# Altium project CartApuce.PrjPcb (part 1 of 2)
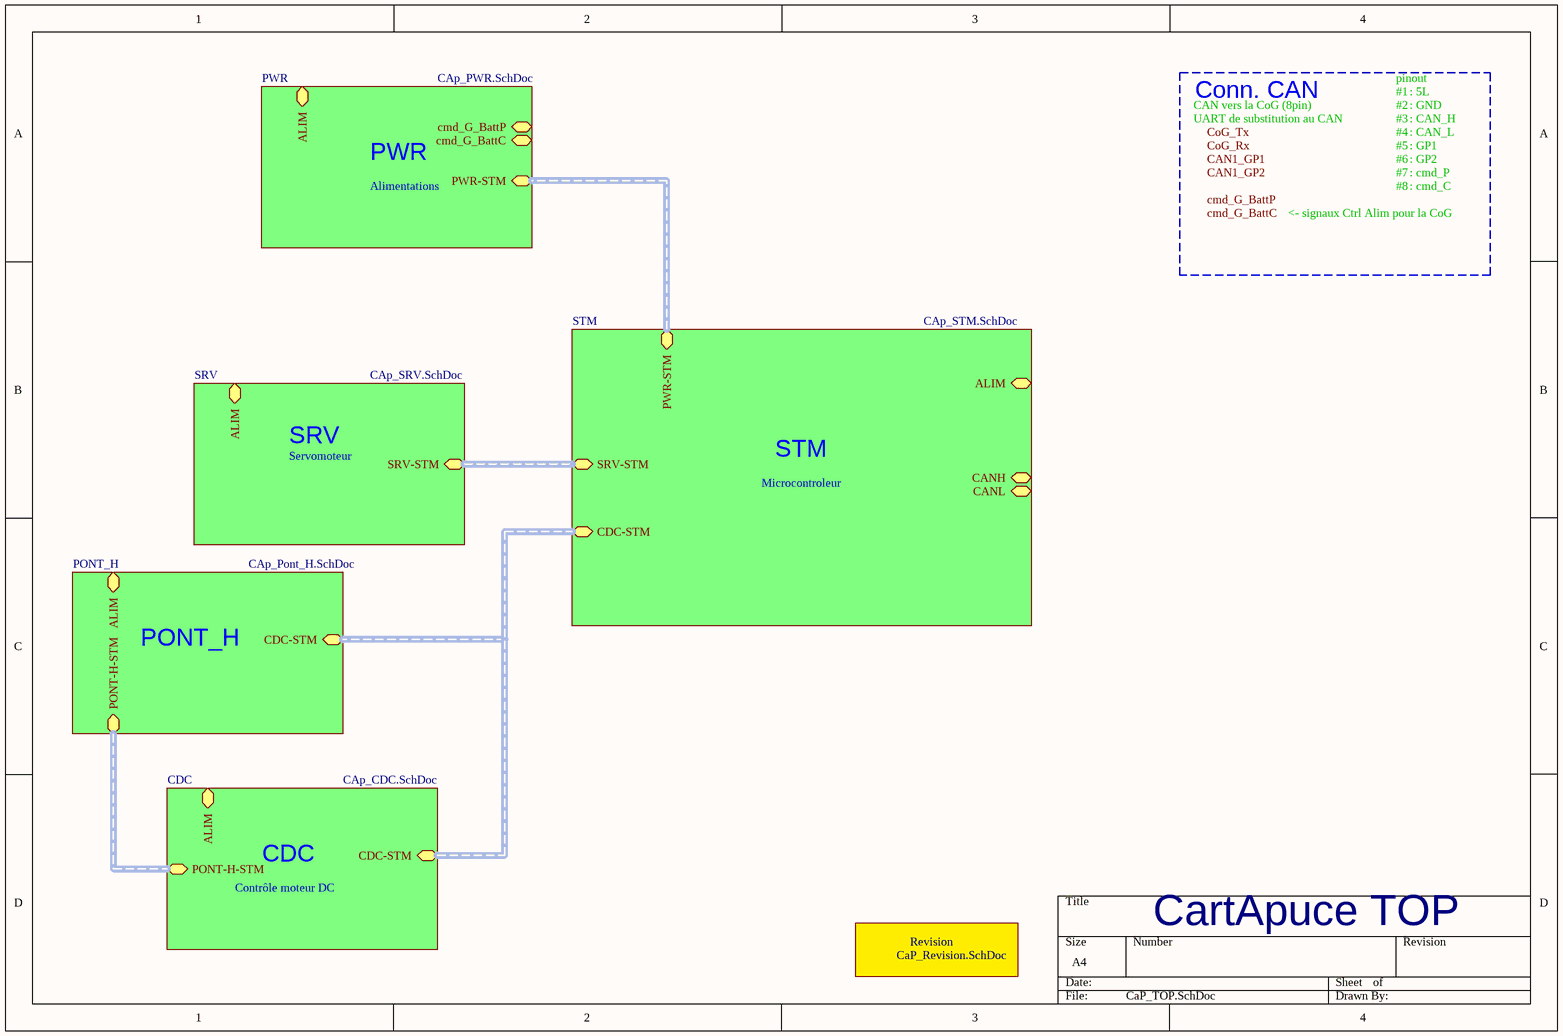
[diagram p0: CaP_TOP.SchDoc]
6 sheets, 259 parts. Net scope: hierarchical (ports join the sheet entries above them; power ports are global).
Board file: CartApuce.PcbDoc
Sheets:
  CaP_TOP.SchDoc
    PWR = CaP_PWR.SchDoc
    SRV = CaP_SRV.SchDoc
    CDC = CaP_CDC.SchDoc
    STM = CaP_STM.SchDoc
    PONT_H = CAp_Pont_H.SchDoc

## Sheet CaP_TOP.SchDoc
size A4; Author: Audran; CompanyName: Goldorak; Address1: Electrolab; Address2: 52 rue Paul Lescop; Address3: 92000 Nanterre; ProjectName: Cartes_2017

### Sub-sheets
CDC = CAp_CDC.SchDoc: CDC-STM (harness CDC-STM), ALIM (harness ALIM), PONT-H-STM (harness PONT-H-STM)
PONT_H = CAp_Pont_H.SchDoc: CDC-STM (harness CDC-STM), ALIM (harness ALIM), PONT-H-STM (harness PONT-H-STM)
PWR = CAp_PWR.SchDoc: PWR-STM (harness PWR-STM), ALIM (harness ALIM), cmd_G_BattP, cmd_G_BattC
Revision = CaP_Revision.SchDoc (file not in this document): no entries
SRV = CAp_SRV.SchDoc: SRV-STM (harness SRV-STM), ALIM (harness ALIM)
STM = CAp_STM.SchDoc: SRV-STM (harness SRV-STM), PWR-STM (harness PWR-STM), CDC-STM (harness CDC-STM), ALIM (harness ALIM), CANH, CANL

### Buses and harness runs
harness sheet CDC/CDC-STM = sheet PONT_H/CDC-STM = sheet STM/CDC-STM
harness sheet CDC/PONT-H-STM = sheet PONT_H/PONT-H-STM
harness sheet PWR/PWR-STM = sheet STM/PWR-STM
harness sheet SRV/SRV-STM = sheet STM/SRV-STM

### Notes on the sheet
- CAN vers la CoG (8pin)
- Conn. CAN
- #1
- #2
- pinout
- : 5L
- : GND
- PWR
- UART de substitution au CAN
- #3
- #4
- #5
- #6
- #7
- : CAN_H
- : CAN_L
- : GP1
- : GP2
- : cmd_P
- Alimentations
- <- signaux Ctrl Alim pour la CoG
- #8
- : cmd_C
- SRV
- Servomoteur
- Microcontroleur
- STM
- PONT_H
- Contrôle moteur DC
- CDC
- CartApuce TOP
- Labels drawn without touching a wire or pin: CAN1_GP1, CAN1_GP2, cmd_G_BattC, cmd_G_BattP, CoG_Rx, CoG_Tx

## Sheet CaP_PWR.SchDoc
size A2; Author: Audran; CompanyName: Goldorak; Address1: Electrolab; Address2: 52 rue Paul Lescop; Address3: 92000 Nanterre; ProjectName: Cartes_2017
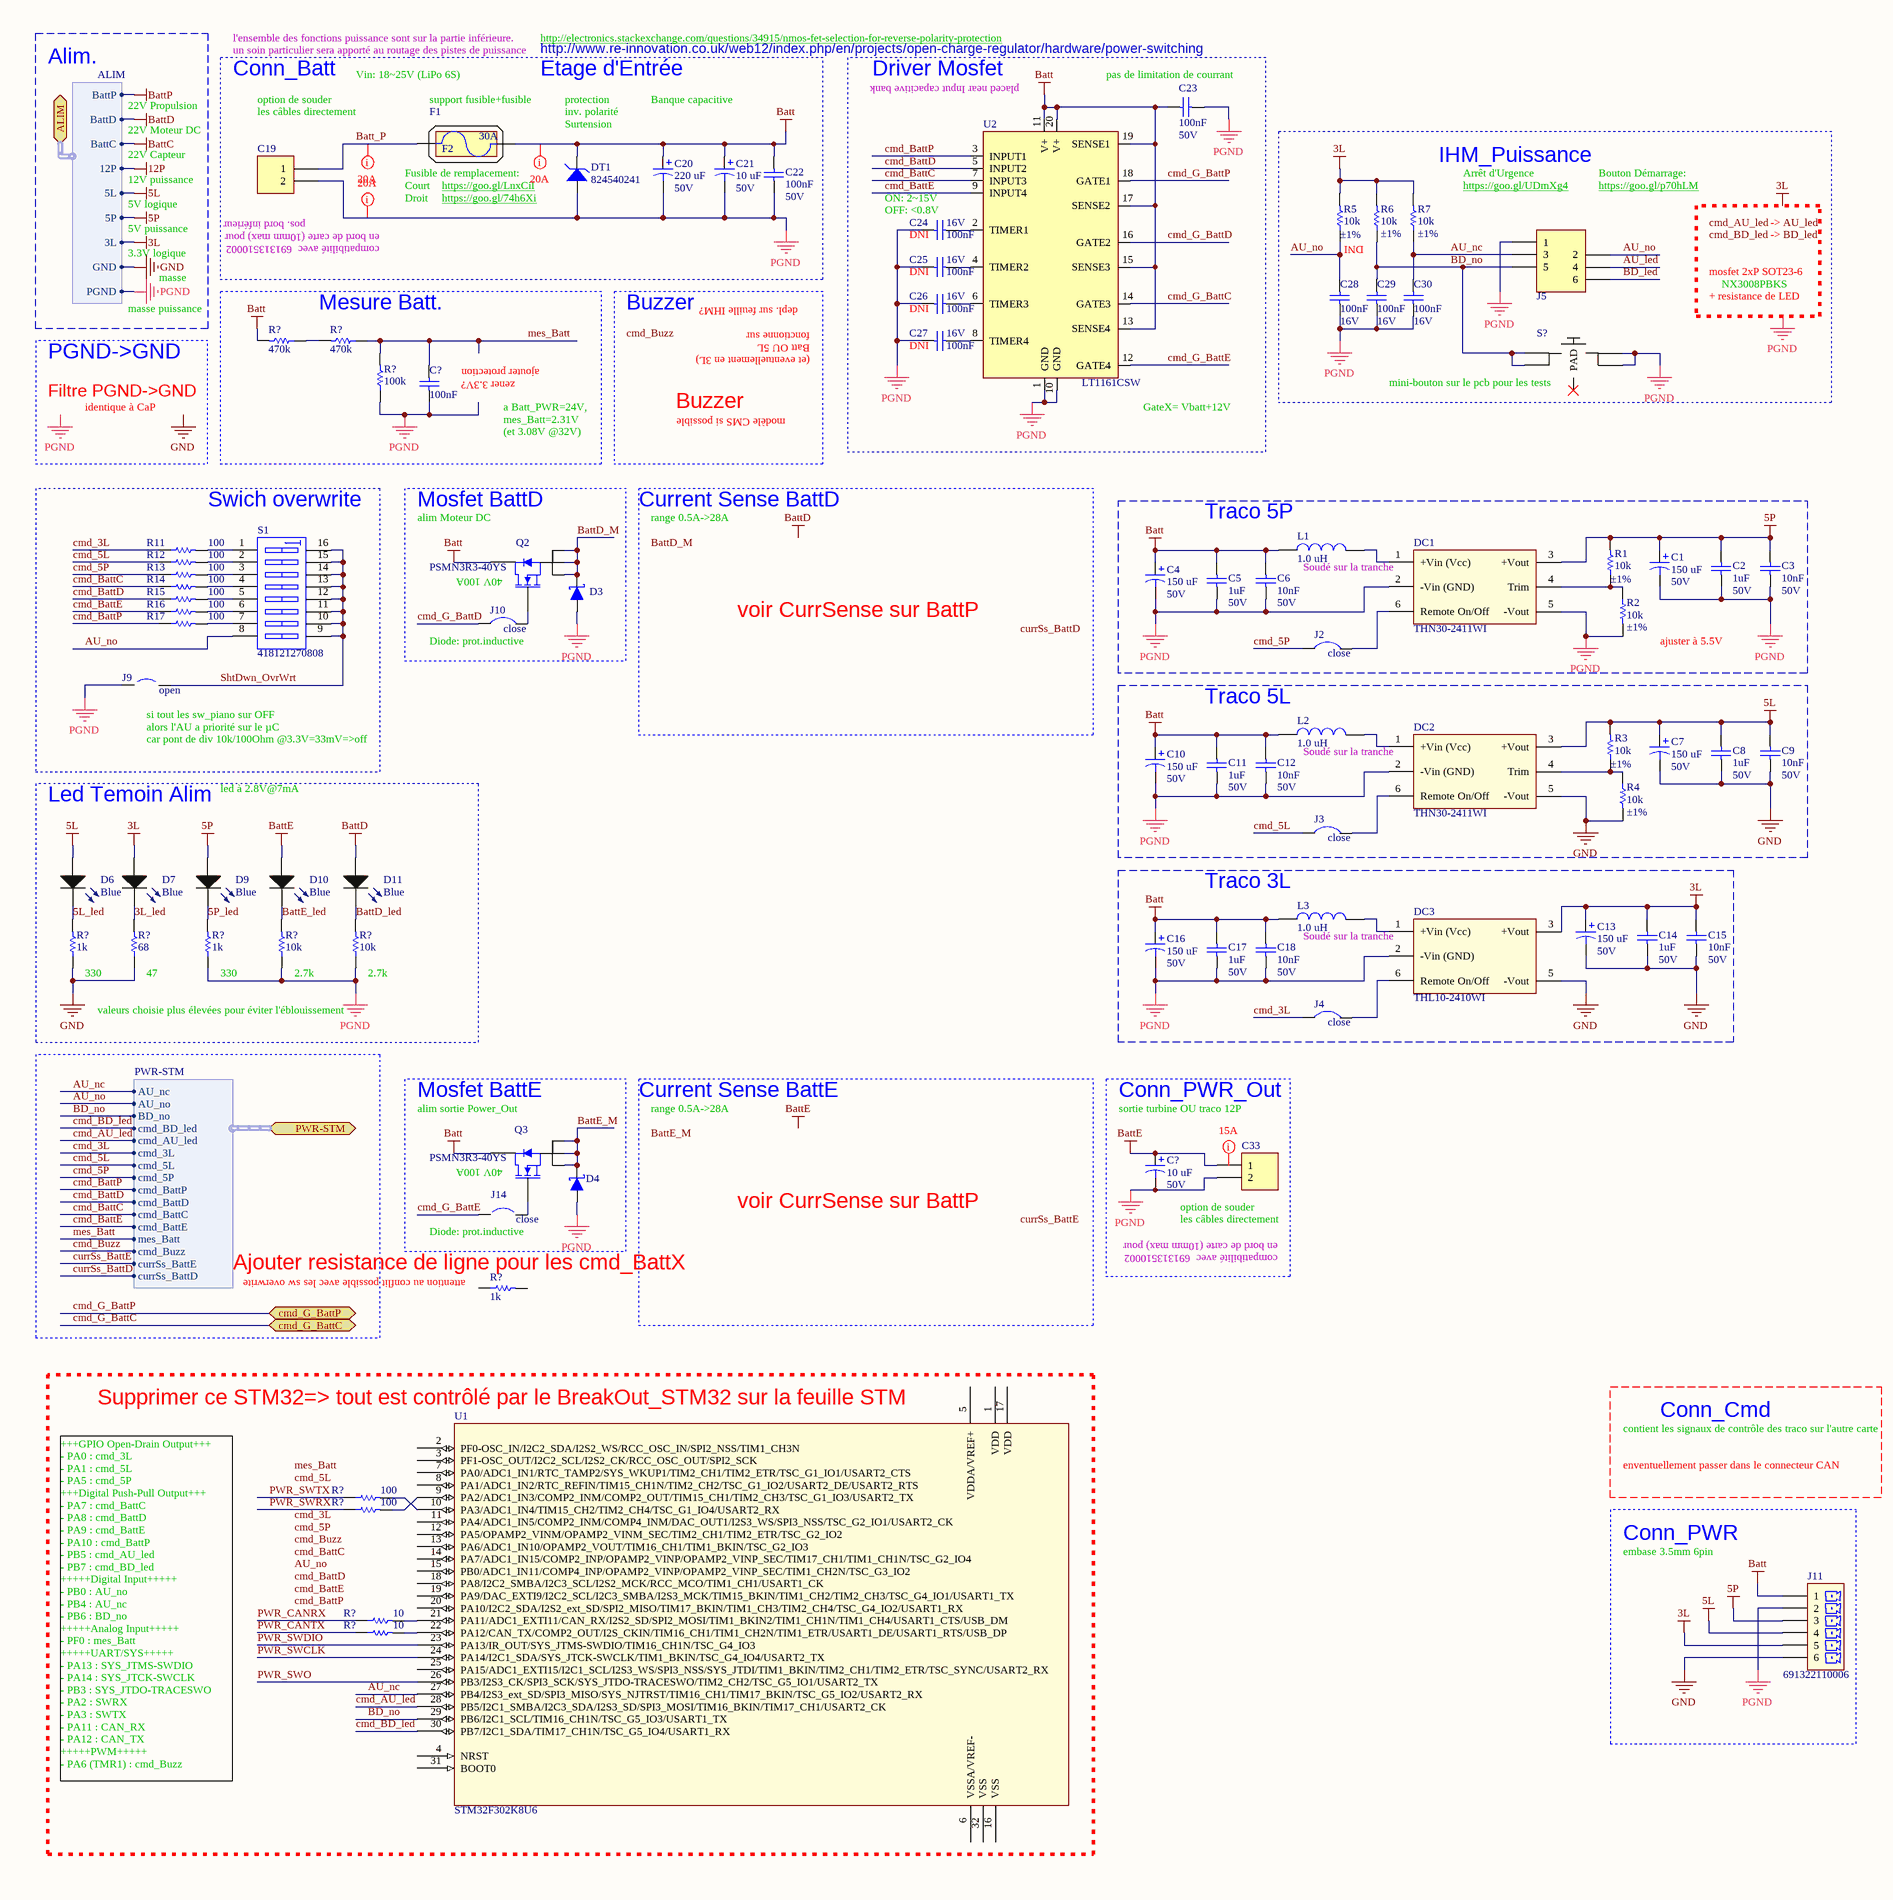
[diagram p1: CaP_PWR.SchDoc, left]
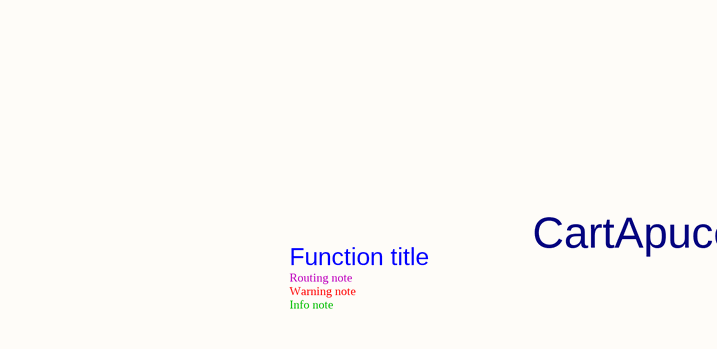
[diagram p2: CaP_PWR.SchDoc, right]

### Parts
(Parts that share a designator on the sheet are numbered #1, #2 ... from top to bottom, then left to right.)
C1#1  150 uF  RatedVoltage: 50V  [WCAP-ATG8_10x12.5x5x0.6]
C2#1  1uF  RatedVoltage: 50V  [WCAP-CSGP_0805, 2x1.25x1.25]
C3  10nF  RatedVoltage: 50V  [WCAP-CSGP_0603, 1.6x0.8x0.8]
C4  150 uF  RatedVoltage: 50V  [WCAP-ATG8_10x12.5x5x0.6]
C5  1uF  RatedVoltage: 50V  [WCAP-CSGP_0805, 2x1.25x1.25]
C6  10nF  RatedVoltage: 50V  [WCAP-CSGP_0603, 1.6x0.8x0.8]
C7  150 uF  RatedVoltage: 50V  [WCAP-ATG8_10x12.5x5x0.6]
C8  1uF  RatedVoltage: 50V  [WCAP-CSGP_0805, 2x1.25x1.25]
C9  10nF  RatedVoltage: 50V  [WCAP-CSGP_0603, 1.6x0.8x0.8]
C10  150 uF  RatedVoltage: 50V  [WCAP-ATG8_10x12.5x5x0.6]
C11  1uF  RatedVoltage: 50V  [WCAP-CSGP_0805, 2x1.25x1.25]
C12  10nF  RatedVoltage: 50V  [WCAP-CSGP_0603, 1.6x0.8x0.8]
C13  150 uF  RatedVoltage: 50V  [WCAP-ATG8_10x12.5x5x0.6]
C14  1uF  RatedVoltage: 50V  [WCAP-CSGP_0805, 2x1.25x1.25]
C15  10nF  RatedVoltage: 50V  [WCAP-CSGP_0603, 1.6x0.8x0.8]
C16  150 uF  RatedVoltage: 50V  [WCAP-ATG8_10x12.5x5x0.6]
C17  1uF  RatedVoltage: 50V  [WCAP-CSGP_0805, 2x1.25x1.25]
C18  10nF  RatedVoltage: 50V  [WCAP-CSGP_0603, 1.6x0.8x0.8]
C19  WE-Terminal Blocks Plugable Type 691311500102  [691311500102]  (value not drawn)
C20  220 uF  RatedVoltage: 50V  [WCAP-ATG8_10x12.5x5x0.6]
C21  10 uF  RatedVoltage: 50V  [WCAP-ATG8_5x11x2x0.5]
C22  100nF  RatedVoltage: 50V  [WCAP-CSGP_0603, 1.6x0.8x0.8]
C23  100nF  RatedVoltage: 50V  [WCAP-CSGP_0603, 1.6x0.8x0.8]
C24  100nF  RatedVoltage: 16V  [WCAP-CSGP_0402, 1x0.5x0.5]
C25  100nF  RatedVoltage: 16V  [WCAP-CSGP_0402, 1x0.5x0.5]
C26  100nF  RatedVoltage: 16V  [WCAP-CSGP_0402, 1x0.5x0.5]
C27  100nF  RatedVoltage: 16V  [WCAP-CSGP_0402, 1x0.5x0.5]
C28  100nF  RatedVoltage: 16V  [WCAP-CSGP_0402, 1x0.5x0.5]
C29  100nF  RatedVoltage: 16V  [WCAP-CSGP_0402, 1x0.5x0.5]
C30  100nF  RatedVoltage: 16V  [WCAP-CSGP_0402, 1x0.5x0.5]
C33  WE-Terminal Blocks Plugable Type 691311500102  [691311500102]  (value not drawn)
C?#1  100nF  [WCAP-CSGP_0402, 1x0.5x0.5]
C?#2  10 uF  RatedVoltage: 50V  [WCAP-ATG8_5x11x2x0.5]
D3  RBR3MM40ATFTR  [SOD-123FL]  (value not drawn)
D4  RBR3MM40ATFTR  [SOD-123FL]  (value not drawn)
D6  Blue  [0603]
D7  Blue  [0603]
D9  Blue  [0603]
D10  Blue  [0603]
D11  Blue  [0603]
DC1  THN30-2411WI  [THL 30WI]
DC2  THN30-2411WI  [THL 30WI]
DC3  THL10-2410WI  [THL 10WI]
DT1  824540241  [DO-214AB_Unidirectional]
F1  3557-2  (value not drawn)
F2  Courant nominal: 30A  (hidden comment: 0891030.NXS)  (mechanical)
J2  close  [CAVALIER_0603_C]  (no BOM)
J3  close  [CAVALIER_0603_C]  (no BOM)
J4  close  [CAVALIER_0603_C]  (no BOM)
J5  (no value)  [690367280676]
J9  open  [CAVALIER_0603_O]  (no BOM)
J10  close  [CAVALIER_0603_C]  (no BOM)
J11  691322110006  [691322110006]
J14  close  [SB_0603]  (no BOM)
L1  value 1.0 uH  [WE-PMCI_1210 Side]  (hidden comment: 74479298210)
L2  value 1.0 uH  [WE-PMCI_1210 Side]  (hidden comment: 74479298210)
L3  value 1.0 uH  [WE-PMCI_1210 Side]  (hidden comment: 74479298210)
Q2  PSMN3R3-40YS  [LFPAK (SOT669)]
Q3  PSMN3R3-40YS  [LFPAK (SOT669)]
R1  value 10k  Precision: ±1%  [RESC1005X04N]  (hidden comment: RC0402FR-0710KL)
R2  value 10k  Precision: ±1%  [RESC1005X04N]  (hidden comment: RC0402FR-0710KL)
R3  value 10k  Precision: ±1%  [RESC1005X04N]  (hidden comment: RC0402FR-0710KL)
R4  value 10k  Precision: ±1%  [RESC1005X04N]  (hidden comment: RC0402FR-0710KL)
R5  value 10k  Precision: ±1%  [RESC1005X04N]  (hidden comment: RC0402FR-0710KL)
R6  value 10k  Precision: ±1%  [RESC1005X04N]  (hidden comment: RC0402FR-0710KL)
R7  value 10k  Precision: ±1%  [RESC1005X04N]  (hidden comment: RC0402FR-0710KL)
R11  value 100  [RESC1005X04N]  (hidden comment: RC0402FR-07100RL)
R12  value 100  [RESC1005X04N]  (hidden comment: RC0402FR-07100RL)
R13  value 100  [RESC1005X04N]  (hidden comment: RC0402FR-07100RL)
R14  value 100  [RESC1005X04N]  (hidden comment: RC0402FR-07100RL)
R15  value 100  [RESC1005X04N]  (hidden comment: RC0402FR-07100RL)
R16  value 100  [RESC1005X04N]  (hidden comment: RC0402FR-07100RL)
R17  value 100  [RESC1005X04N]  (hidden comment: RC0402FR-07100RL)
R?#1  value 470k  [RESC1005X04N]
R?#2  value 470k  [RESC1005X04N]
R?#3  value 100k  [RESC1005X04N]  (hidden comment: RC0402FR-07100KL)
R?#4  value 1k  [RESC1608X06N]  (hidden comment: RC0603FR-071KL)
R?#5  value 68  [RESC1608X06N]  (hidden comment: RC0603FR-0768RL)
R?#6  value 1k  [RESC1608X06N]  (hidden comment: RC0603FR-071KL)
R?#7  value 10k  [RESC1608X06N]  (hidden comment: RC0603FR-0710KL)
R?#8  value 10k  [RESC1608X06N]  (hidden comment: RC0603FR-0710KL)
R?#9  value 1k  [RESC1005X04N]  (hidden comment: RC0402FR-071KL)
R?#10  value 100  [RESC1005X04N]  (hidden comment: RC0402FR-07100RL)
R?#11  value 100  [RESC1005X04N]  (hidden comment: RC0402FR-07100RL)
R?#12  value 10  [RESC1005X04N]  (hidden comment: RC0402FR-0710RL)
R?#13  value 10  [RESC1005X04N]  (hidden comment: RC0402FR-0710RL)
S1  418121270808  [418121270808]
S?  MCITPG  [MCIPTG23K-V]  (value not drawn)
U1  STM32F302K8U6  [QFN50P500X500X60_HS-33N]
U2  LT1161CSW  [SOIC127P1030X264-20N]

### Blocks framed on the sheet
Driver Mosfet: C23-C27 U2
IHM_Puissance: C28-C30 J5 R5-R7 S?
Mesure Batt.: C?#1 R?#1-R?#3
Swich overwrite: J9 R11-R17 S1
Mosfet BattD: D3 J10 Q2
Traco 5P: C1#1 C2#1 C3-C6 DC1 J2 L1 R1 R2
Traco 5L: C7-C12 DC2 J3 L2 R3 R4
Led Temoin Alim: D6 D7 D9-D11 R?#4-R?#8
Traco 3L: C13-C18 DC3 J4 L3
Mosfet BattE: D4 J14 Q3
Conn_PWR_Out: C33 C?#2
Conn_PWR: J11

### Ports
ALIM (harness ALIM), cmd_G_BattC, cmd_G_BattP, PWR-STM (harness PWR-STM)

### Harnesses
PWR-STM: AU_nc, AU_no, BD_no, cmd_BD_led, cmd_AU_led, cmd_3L, cmd_5L, cmd_5P, cmd_BattP, cmd_BattC, cmd_BattE, mes_Batt, cmd_BattD, cmd_Buzz, currSs_BattE, currSs_BattD
ALIM: BattP, BattD, BattC, 12P, 5L, 5P, 3L, GND, PGND

### Nets
3L: C13.1 C14.2 C15.2 D7.2(A) DC3.3(+Vout) J11.5 R5.2 R6.2 R7.2 ; port ALIM.3L
5L: C7.1 C8.2 C9.2 D6.2(A) DC2.3(+Vout) J11.4 R3.2 ; port ALIM.5L
5P: C1#1.1 C2#1.2 C3.2 D9.2(A) DC1.3(+Vout) J11.3 R1.2 ; port ALIM.5P
12P: port ALIM.12P
Batt: C4.1 C5.2 C6.2 C10.1 C11.2 C12.2 C16.1 C17.2 C18.2 C20.1 C21.1 C22.2 C23.2 DT1.2 F1.2 J11.1 L1.1 L2.1 L3.1 Q2.5(D) Q3.5(D) R?#1.2 U2.11(V+) U2.13(SENSE4) U2.15(SENSE3) U2.17(SENSE2) U2.19(SENSE1) U2.20(V+)
BattD: D11.2(A) ; port ALIM.BattD
BattE: C33.1 C?#2.1 D10.2(A)
GND: C7.2 C8.1 C9.1 C13.2 C14.1 C15.1 DC2.5(-Vout) DC3.5(-Vout) J11.6 R4.2 R?#4.1 R?#5.1 ; port ALIM.GND
PGND: C1#1.2 C2#1.1 C3.1 C4.2 C5.1 C6.1 C10.2 C11.1 C12.1 C16.2 C17.1 C18.1 C19.2 C20.2 C21.2 C22.1 C23.1 C24.1 C25.1 C26.1 C27.1 C28.1 C29.1 C30.1 C33.2 C?#1.1 C?#2.2 D3.1 D4.1 DC1.2(-Vin_(GND)) DC1.5(-Vout) DC2.2(-Vin_(GND)) DC3.2(-Vin_(GND)) DT1.1 J5.1 J9.1 J11.2 R2.2 R?#3.1 R?#6.1 R?#7.1 R?#8.1 S?.2 S?.4 U2.1(GND) U2.10(GND) ; port ALIM.PGND
3L_led: D7.1(C) R?#5.2
5L_led: D6.1(C) R?#4.2
5P_led: D9.1(C) R?#6.2
AU_led: J5.4
AU_nc: C30.2 J5.3 R7.1 U1.27(PB4/I2S3_ext_SD/SPI3_MISO/SYS_NJTRST/TIM16_CH1/TIM17_BKIN/TSC_G5_IO2/USART2_RX) ; port PWR-STM.AU_nc
AU_no: C28.2 J5.2 R5.1 S1.8 ; port PWR-STM.AU_no
Batt_P: C19.1 F1.1
BattD_led: D11.1(C) R?#8.2
BattD_M: D3.2 Q2.1(S) Q2.2(S) Q2.3(S)
BattE_led: D10.1(C) R?#7.2
BattE_M: D4.2 Q3.1(S) Q3.2(S) Q3.3(S)
BD_led: J5.6
BD_no: C29.2 J5.5 R6.1 S?.1 S?.3 U1.29(PB6/I2C1_SCL/TIM16_CH1N/TSC_G5_IO3/USART1_TX) ; port PWR-STM.BD_no
cmd_3L: J4.1 R11.1 ; port PWR-STM.cmd_3L
cmd_5L: J3.1 R12.1 ; port PWR-STM.cmd_5L
cmd_5P: J2.1 R13.1 ; port PWR-STM.cmd_5P
cmd_AU_led: U1.28(PB5/I2C1_SMBA/I2C3_SDA/I2S3_SD/SPI3_MOSI/TIM16_BKIN/TIM17_CH1/USART2_CK) ; port PWR-STM.cmd_AU_led
cmd_BattC: R14.1 U2.7(INPUT3) ; port PWR-STM.cmd_BattC
cmd_BattD: R15.1 U2.5(INPUT2) ; port PWR-STM.cmd_BattD
cmd_BattE: R16.1 U2.9(INPUT4) ; port PWR-STM.cmd_BattE
cmd_BattP: R17.1 U2.3(INPUT1) ; port PWR-STM.cmd_BattP
cmd_BD_led: U1.30(PB7/I2C1_SDA/TIM17_CH1N/TSC_G5_IO4/USART1_RX) ; port PWR-STM.cmd_BD_led
cmd_Buzz: port PWR-STM.cmd_Buzz
cmd_G_BattC: U2.14(GATE3) ; port cmd_G_BattC
cmd_G_BattD: J10.1 U2.16(GATE2)
cmd_G_BattE: J14.1 U2.12(GATE4)
cmd_G_BattP: U2.18(GATE1) ; port cmd_G_BattP
currSs_BattD: port PWR-STM.currSs_BattD
currSs_BattE: port PWR-STM.currSs_BattE
mes_Batt: C?#1.2 R?#2.1 R?#3.2 ; port PWR-STM.mes_Batt
PWR_CANRX: R?#12.1
PWR_CANTX: R?#13.1
PWR_SWCLK: U1.24(PA14/I2C1_SDA/SYS_JTCK-SWCLK/TIM1_BKIN/TSC_G4_IO4/USART2_TX)
PWR_SWDIO: U1.23(PA13/IR_OUT/SYS_JTMS-SWDIO/TIM16_CH1N/TSC_G4_IO3)
PWR_SWO: U1.26(PB3/I2S3_CK/SPI3_SCK/SYS_JTDO-TRACESWO/TIM2_CH2/TSC_G5_IO1/USART2_TX)
PWR_SWRX: R?#11.1
PWR_SWTX: R?#10.1
ShtDwn_OvrWrt: J9.2 S1.9 S1.10 S1.11 S1.12 S1.13 S1.14 S1.15 S1.16
NetC24_2: C24.2 U2.2(TIMER1)
NetC25_2: C25.2 U2.4(TIMER2)
NetC26_2: C26.2 U2.6(TIMER3)
NetC27_2: C27.2 U2.8(TIMER4)
NetDC1_1: DC1.1(+Vin_(Vcc)) L1.2
NetDC1_4: DC1.4(Trim) R1.1 R2.1
NetDC1_6: DC1.6(Remote_On/Off) J2.2
NetDC2_1: DC2.1(+Vin_(Vcc)) L2.2
NetDC2_4: DC2.4(Trim) R3.1 R4.1
NetDC2_6: DC2.6(Remote_On/Off) J3.2
NetDC3_1: DC3.1(+Vin_(Vcc)) L3.2
NetDC3_6: DC3.6(Remote_On/Off) J4.2
NetJ10_2: J10.2 Q2.4(G)
NetJ14_2: J14.2 Q3.4(G)
NetR11_2: R11.2 S1.1
NetR12_2: R12.2 S1.2
NetR13_2: R13.2 S1.3
NetR14_2: R14.2 S1.4
NetR15_2: R15.2 S1.5
NetR16_2: R16.2 S1.6
NetR17_2: R17.2 S1.7
NetR?#1_1: R?#1.1 R?#2.2
NetR?#10_2: R?#10.2 U1.10(PA3/ADC1_IN4/TIM15_CH2/TIM2_CH4/TSC_G1_IO4/USART2_RX)
NetR?#11_2: R?#11.2 U1.9(PA2/ADC1_IN3/COMP2_INM/COMP2_OUT/TIM15_CH1/TIM2_CH3/TSC_G1_IO3/USART2_TX)
NetR?#12_2: R?#12.2 U1.21(PA11/ADC1_EXTI11/CAN_RX/I2S2_SD/SPI2_MOSI/TIM1_BKIN2/TIM1_CH1N/TIM1_CH4/USART1_CTS/USB_DM)
NetR?#13_2: R?#13.2 U1.22(PA12/CAN_TX/COMP2_OUT/I2S_CKIN/TIM16_CH1/TIM1_CH2N/TIM1_ETR/USART1_DE/USART1_RTS/USB_DP)

Not connected (* = marked no-connect by the designer): DC3 4(nc); R?#9 1 2; S? 5(PAD)*; U1 1(VDD) 2(PF0-OSC_IN/I2C2_SDA/I2S2_WS/RCC_OSC_IN/SPI2_NSS/TIM1_CH3N) 3(PF1-OSC_OUT/I2C2_SCL/I2S2_CK/RCC_OSC_OUT/SPI2_SCK) 4(NRST) 5(VDDA/VREF+) 6(VSSA/VREF-) 7(PA0/ADC1_IN1/RTC_TAMP2/SYS_WKUP1/TIM2_CH1/TIM2_ETR/TSC_G1_IO1/USART2_CTS) 8(PA1/ADC1_IN2/RTC_REFIN/TIM15_CH1N/TIM2_CH2/TSC_G1_IO2/USART2_DE/USART2_RTS) 11(PA4/ADC1_IN5/COMP2_INM/COMP4_INM/DAC_OUT1/I2S3_WS/SPI3_NSS/TSC_G2_IO1/USART2_CK) 12(PA5/OPAMP2_VINM/OPAMP2_VINM_SEC/TIM2_CH1/TIM2_ETR/TSC_G2_IO2) 13(PA6/ADC1_IN10/OPAMP2_VOUT/TIM16_CH1/TIM1_BKIN/TSC_G2_IO3) 14(PA7/ADC1_IN15/COMP2_INP/OPAMP2_VINP/OPAMP2_VINP_SEC/TIM17_CH1/TIM1_CH1N/TSC_G2_IO4) 15(PB0/ADC1_IN11/COMP4_INP/OPAMP2_VINP/OPAMP2_VINP_SEC/TIM1_CH2N/TSC_G3_IO2) 16(VSS) 17(VDD) 18(PA8/I2C2_SMBA/I2C3_SCL/I2S2_MCK/RCC_MCO/TIM1_CH1/USART1_CK) 19(PA9/DAC_EXTI9/I2C2_SCL/I2C3_SMBA/I2S3_MCK/TIM15_BKIN/TIM1_CH2/TIM2_CH3/TSC_G4_IO1/USART1_TX) 20(PA10/I2C2_SDA/I2S2_ext_SD/SPI2_MISO/TIM17_BKIN/TIM1_CH3/TIM2_CH4/TSC_G4_IO2/USART1_RX) 25(PA15/ADC1_EXTI15/I2C1_SCL/I2S3_WS/SPI3_NSS/SYS_JTDI/TIM1_BKIN/TIM2_CH1/TIM2_ETR/TSC_SYNC/USART2_RX) 31(BOOT0) 32(VSS)

### Layout directives
net class PWR_20A: Batt, Batt_P, PGND
net class PWR_15A: (no net found under the mark)

### Notes on the sheet
- Alim.
- Conn_Batt
- l'ensemble des fonctions puissance sont sur la partie inférieure.
- un soin particulier sera apporté au routage des pistes de puissance
- Vin: 18~25V (LiPo 6S)
- Etage d'Entrée
- http://electronics.stackexchange.com/questions/34915/nmos-fet-selection-for-reverse-polarity-protection
- http://www.re-innovation.co.uk/web12/index.php/en/projects/open-charge-regulator/hardware/power-switching
- (near U2) placed near Input capacitive bank
- (near C23) pas de limitation de courrant
- 22V Propulsion
- 22V Moteur DC
- option de souder
- les câbles directement
- support fusible+fusible
- protection
- inv. polarité
- Surtension
- Banque capacitive
- 5V logique
- 12V puissance
- 22V Capteur
- (near C19) pos. bord inférieur
- Droit
- Court
- Fusible de remplacement:
- (near DT1) https://goo.gl/74h6Xi
- (near DT1) https://goo.gl/LnxCil
- (near C24) ON: 2~15V
- (near C24) OFF: <0.8V
- https://goo.gl/UDmXg4
- Arrêt d'Urgence
- Bouton Démarrage:
- https://goo.gl/p70hLM
- 5V puissance
- 3.3V logique
- compatibilité avec  691313510002
- en bord de carte (10mm max) pour
- (near C24) DNI
- (near C25) DNI
- DNI
- mosfet 2xP SOT23-6
- ->
- masse puissance
- masse
- Buzzer
- depl. sur feuille IHM?
- fonctionne sur
- Batt OU 5L
- (near C26) DNI
- + resistance de LED
- NX3008PBKS
- Filtre PGND->GND
- PGND->GND
- (near C?#1) zener 3.3V?
- (near C?#1) ajouter protection
- (et eventuellement en 3L)
- (near C27) DNI
- (near S?) mini-bouton sur le pcb pour les tests
- identique à CaP
- a Batt_PWR=24V,
- mes_Batt=2.31V
- (et 3.08V @32V)
- modèle CMS si possible
- (near U2) GateX= Vbatt+12V
- (near Q2) alim Moteur DC
- Current Sense BattD
- range 0.5A->28A
- (near Q2) 40V 100A
- (near DC1) Soudé sur la tranche
- (near J10) Diode: prot.inductive
- voir CurrSense sur BattP
- ajuster à 5.5V
- (near J9) si tout les sw_piano sur OFF
- (near J9) alors l'AU a priorité sur le µC
- car pont de div 10k/100Ohm @3.3V=33mV=>off
- (near DC2) Soudé sur la tranche
- led à 2.8V@7mA
- (near DC3) Soudé sur la tranche
- (near R?#4) 330
- valeurs choisie plus élevées pour éviter l'éblouissement
- (near R?#5) 47
- (near R?#6) 330
- (near R?#7) 2.7k
- (near R?#8) 2.7k
- (near Q3) alim sortie Power_Out
- Current Sense BattE
- sortie turbine OU traco 12P
- (near Q3) 40V 100A
- (near J14) Diode: prot.inductive
- (near R?#9) Ajouter resistance de ligne pour les cmd_BattX
- (near R?#9) attention au conflit possible avec les sw overwrite
- (near U1) Supprimer ce STM32=> tout est contrôlé par le BreakOut_STM32 sur la feuille STM
- contient les signaux de contrôle des traco sur l'autre carte
- Conn_Cmd
- enventuellement passer dans le connecteur CAN
- embase 3.5mm 6pin
- +++GPIO Open-Drain Output+++
  - PA0 : cmd_3L
  - PA1 : cmd_5L
  - PA5 : cmd_5P
  +++Digital Push-Pull Output+++
  - PA7 : cmd_BattC
  - PA8 : cmd_BattD
  - PA9 : cmd_BattE
  - PA10 : cmd_BattP
  - PB5 : cmd_AU_led
  - PB7 : cmd_BD_led
  +++++Digital Input+++++
  - PB0 : AU_no
  - PB4 : AU_nc
  - PB6 : BD_no
  +++++Analog Input+++++
  - PF0 : mes_Batt
  +++++UART/SYS+++++
  - PA13 : SYS_JTMS-SWDIO
  - PA14 : SYS_JTCK-SWCLK
  - PB3 : SYS_JTDO-TRACESWO
  - PA2 : SWRX
  - PA3 : SWTX
  - PA11 : CAN_RX
  - PA12 : CAN_TX
  +++++PWM+++++
  - PA6 (TMR1) : cmd_Buzz
- CartApuce_PWR
- Routing note
- Warning note
- Info note
- Function title
- Labels drawn without touching a wire or pin: 3L, AU_led, AU_no, BattD, BattD_M, BattE, BattE_M, BD_led, cmd_3L, cmd_5L, cmd_5P, cmd_AU_led, cmd_BattC, cmd_BattD, cmd_BattE, cmd_BattP, cmd_BD_led, cmd_Buzz, currSs_BattD, currSs_BattE, GND, mes_Batt, PGND

### Library data of the parts
C1#1 C4 C7 C10 C13 C16 = WCAP-ATG8, 860010675016: CAP Alu 150 UF 20% 50 V; Manufacturer: Wurth Elektronik; PublishedDate: July 2016; ComponentLink1Description: Manufacturer; ComponentLink1URL: http://www.we-online.de; ComponentLink2Description: Datasheet; ComponentLink2URL: http://katalog.we-online.de/pbs/datasheet/860010675016.pdf; Value: 150 uF; Size: 10mmx12.5mm; Manufacturer Part Number: 860010675016
C2#1 C5 C8 C11 C14 C17 = WCAP-CSGP, 885012207103: CAP CER 1uF 50V X7R 0805; Manufacturer: Wurth Elektronik; PublishedDate: Aug 2016; ComponentLink1Description: Manufacturer; ComponentLink1URL: http://www.we-online.de; ComponentLink2Description: Datasheet; ComponentLink2URL: http://katalog.we-online.com/pbs/datasheet/885012207103.pdf; Value: 1uF; Size: 0805; CeramicType: X7R; Manufacturer Part Number: 885012207103
C3 C6 C9 C12 C15 C18 = WCAP-CSGP, 885012206089: CAP CER 10nF 50V X7R 0603; Manufacturer: Wurth Elektronik; PublishedDate: Aug 2016; ComponentLink1Description: Manufacturer; ComponentLink1URL: http://www.we-online.de; ComponentLink2Description: Datasheet; ComponentLink2URL: http://katalog.we-online.com/pbs/datasheet/885012206089.pdf; Value: 10nF; Size: 0603; CeramicType: X7R; Manufacturer Part Number: 885012206089
C19 C33 = WE-Terminal Blocks Plugable Type 691311500102: WR-TBL Terminal block - serie 311 Closed - 5.08mm; Manufacturer 1: Wurth Elektronik eiSos GmbH; ComponentLink1 Description: Manufacturer; ComponentLink2 Description: Datasheet; NoPins: 02; Created Date: 8 January 2014; Manufacturer Part Number: 691311500102; ComponentLink1URL: http://www.we-online.com; ComponentLink2URL: http://katalog.we-online.de/em/datasheet/6913115001xx.pdf; Created by: Karrer Zheng; Supplier 1: Farnell; Supplier Part Number 1: 1641978
C20 = WCAP-ATG8, 860010675018: CAP Alu 220 UF 20% 50 V; Manufacturer: Wurth Elektronik; PublishedDate: July 2016; ComponentLink1Description: Manufacturer; ComponentLink1URL: http://www.we-online.de; ComponentLink2Description: Datasheet; ComponentLink2URL: http://katalog.we-online.de/pbs/datasheet/860010675018.pdf; Value: 220 uF; Size: 10mmx12.5mm; Manufacturer Part Number: 860010675018
C21 C?#2 = WCAP-ATG8, 860010672009: CAP Alu 10 UF 20% 50 V; Manufacturer: Wurth Elektronik; PublishedDate: July 2016; ComponentLink1Description: Manufacturer; ComponentLink1URL: http://www.we-online.de; ComponentLink2Description: Datasheet; ComponentLink2URL: http://katalog.we-online.de/pbs/datasheet/860010672009.pdf; Value: 10 uF; Size: 5mmx11mm; Manufacturer Part Number: 860010672009
C22 C23 = WCAP-CSGP, 885012206095: CAP CER 100nF 50V X7R 0603; Manufacturer: Wurth Elektronik; PublishedDate: Aug 2016; ComponentLink1Description: Manufacturer; ComponentLink1URL: http://www.we-online.de; ComponentLink2Description: Datasheet; ComponentLink2URL: http://katalog.we-online.com/pbs/datasheet/885012206095.pdf; Value: 100nF; Size: 0603; CeramicType: X7R; Manufacturer Part Number: 885012206095
C24-C30 C?#1 = WCAP-CSGP, 885012205037: CAP CER 100nF 16V X7R 0402; Manufacturer: Wurth Elektronik; PublishedDate: Aug 2016; ComponentLink1Description: Manufacturer; ComponentLink1URL: http://www.we-online.de; ComponentLink2Description: Datasheet; ComponentLink2URL: http://katalog.we-online.com/pbs/datasheet/885012205037.pdf; Value: 100nF; Size: 0402; CeramicType: X7R; Manufacturer Part Number: 885012205037
  C?#1: RatedVoltage: 16V
D3 D4 = RBR3MM40ATFTR: DIODE SCHOTTKY 40V 3A SOD123-FL; Manufacturer: ROHM; Type: Schottky; ReverseVoltage: 40V; ContinuousForwardCurrent: 3A; ComponentLink1Description: Manufacturer; ComponentLink1URL: http://www.rohm.com/web/global/products/-/product/RBR3MM40ATF; ComponentLink2URL: http://www.farnell.com/datasheets/2067190.pdf; ComponentLink2Description: Datasheet; Supplier 1: Farnell; Supplier Part Number 1: 2581593; Manufacturer Part Number: RBR3MM40ATFTR
D6 D7 D9-D11 = WL-SMCW 0603  150060BS75000: SMD mono-color Chip LED, WL-SMCW, Blue; Manufacturer 1: Würth Elektronik eiSos GmbH; Manufacturer Part Number: 150060BS75000; ComponentLink1Description: Manufacturer; ComponentLink1URL: http://www.we-online.de; Created by: Christin Otto; Created Date: June 2013; ComponentLink2Description: Datasheet; ComponentLink2URL: http://katalog.we-online.com/led/datasheet/150060BS75000.pdf; Color: Blue; Value: Blue; Supplier 1: Farnell; Supplier Part Number 1: 2322069
DC1 DC2 = THN30-2411WI: Traco 5V 30W 6A; Manufacturer: TRACOPOWER; Manufacturer Part Number: THN30-2411WI; Pricing: 1=65.7, 5=63.73, 10=61.82, 25=59.97 (EUR); ComponentLink1URL: http://www.farnell.com/datasheets/2200567.pdf; ComponentLink1Description: http://www.farnell.com/datasheets/2200567.pdf; Supplier 1: Farnell; Supplier Part Number 1: 2322194
DC3 = THL10-2410WI: Traco 3.3V 2.2A 10W; Manufacturer: TRACOPOWER; Manufacturer Part Number: THL10-2410WI; ComponentLink1URL: http://docs-europe.electrocomponents.com/webdocs/0f87/0900766b80f879b3.pdf; ComponentLink1Description: http://docs-europe.electrocomponents.com/webdocs/0f87/0900766b80f879b3.pdf; Supplier 1: RS; Supplier Part Number 1: 733-1828
DT1 = 824540241: WE-TVSP Power TVS Diode, Unidirectional, 1500 W, 24 VDC; Manufacturer: Wurth Electronics Inc.; Supplier 1: Farnell; Supplier Part Number 1: 2536699; Manufacturer Part Number: 824540241; ComponentLink1URL: http://katalog.we-online.de/pbs/datasheet/824540241.pdf; ComponentLink1Description: Datasheet
F1 = 3557-2: FUSE Holder 500V 30A PCB; Manufacturer: Keystone Electronics; Supplier 1: Farnell; Supplier Part Number 1: 2292904; Manufacturer Part Number: 3557-2; ComponentLink1URL: http://www.keyelco.com/product-pdf.cfm?p=296; ComponentLink1Description: Datasheet; Courant nominal: 30A
F2 = 0891030.NXS: FUSE AUTO 30A 58VDC BLADE MINI; Manufacturer: Littelfuse Inc.; Manufacturer Part Number: 0891030.NXS; Supplier 1: Digi-Key; Supplier Part Number 1: F4993-ND; ComponentLink1URL: http://www.littelfuse.com/~/media/automotive/datasheets/fuses/passenger-car-and-commercial-vehicle/blade-fuses/littelfuse_lowprofilemini_datasheet.pdf; ComponentLink1Description: Datasheet
J2-J4 J10 = CAVALIER_0603_C: Cavalier soudure "fermé" + empreinte dipole 0603
J5 = 690367280676: WR-MM Female SMT Connector with Polarization; Manufacturer 1: W¨¹rth Elektronik eiSos GmbH; ComponentLink1 Description: Manufacturer; ComponentLink2 Description: Datasheet; Value: 6; ComponentLink1URL: http://www.we-online.com; ComponentLink2URL: http://katalog.we-online.de/em/datasheet/69036728xx76.pdf; Manufacturer Part Number: 690367280676; Supplier 1: Farnell; Supplier Part Number 1: 1641849
J9 = CAVALIER_0603_O: Cavalier soudure "ouvert" + empreinte dipole 0603
J11 = 691322110006: TERM BLOCK HDR 6POS 90DEG 3.5MM; Manufacturer: Wurth Electronics Inc.; Supplier 1: Farnell; Manufacturer Part Number: 691322110006; ComponentLink1URL: http://katalog.we-online.de/em/datasheet/6913221100xx.pdf; ComponentLink1Description: Datasheet; Supplier Part Number 1: 1841319
J14 = CAVALIER_0603: Circuit Breaker (cavalier soudure) empreinte dipole 0603
L1-L3 = 74479298210: FIXED IND 1UH 2.5A 54 MOHM SMD 1210; PublishedDate: Nov. 2016; Publisher: Wurth Elektronik; ComponentLink1Description: Manufacturer; ComponentLink1URL: http://www.we-online.de; ComponentLink2Description: Datasheet; ComponentLink2URL: http://katalog.we-online.de/pbs/datasheet/74479298210.pdf; PartNumber: 74479298210; Size: 1210
Q2 Q3 = PSMN3R3-40YS: MOSFET N  40V 100A LFPAK; Manufacturer: NEXPERIA; Manufacturer Part Number: PSMN3R3-40YS; ComponentLink1URL: http://www.farnell.com/datasheets/1230735.pdf; ComponentLink1Description: Datasheet; Pricing: 1=0.498, 25=0.488, 100=0.486, 250=0.476, 500=0.467, 3000=0.457, 7000=0.447, 20000=0.437 (EUR); Supplier 1: Farnell; Supplier Part Number 1: 1845655
R1-R7 = RC0402FR-0710KL: RES SMD 10K OHM 1% 1/16W 0402; Manufacturer: Yageo; Power: 63mW; Vmax: 50V; Type: Thick Film; ComponentLink1Description: Manufacturer; ComponentLink1URL: http://www.yageo.com/NewPortal/_en/index.jsp; ComponentLink2Description: Datasheet; ComponentLink2URL: http://www.farnell.com/datasheets/2167052.pdf; Supplier 1: Farnell; Supplier Part Number 1: 9239359; Manufacturer Part Number: RC0402FR-0710KL
R11-R17 R?#10 R?#11 = RC0402FR-07100RL: RES SMD 100 OHM 1% 1/16W 0402; Manufacturer: Yageo; Power: 63mW; Vmax: 50V; Type: Thick Film; ComponentLink1Description: Manufacturer; ComponentLink1URL: http://www.yageo.com/NewPortal/_en/index.jsp; ComponentLink2Description: Datasheet; ComponentLink2URL: http://www.farnell.com/datasheets/2167052.pdf; Manufacturer Part Number: RC0402FR-07100RL; Supplier 1: Farnell; Supplier Part Number 1: 9239111; Precision: ±1%
R?#1 R?#2 = RC0402FR-07470KL: RES SMD 470K OHM 1% 1/16W 0402; Manufacturer: Yageo; Power: 63mW; Vmax: 50V; Type: Thick Film; ComponentLink1Description: Manufacturer; ComponentLink1URL: http://www.yageo.com/NewPortal/_en/index.jsp; ComponentLink2Description: Datasheet; ComponentLink2URL: http://www.farnell.com/datasheets/2167052.pdf; Manufacturer Part Number: RC0402FR-07470KL; Supplier 1: Farnell; Supplier Part Number 1: 9239553; Precision: ±1%
R?#3 = RC0402FR-07100KL: RES SMD 100K OHM 1% 1/16W 0402; Manufacturer: Yageo; Power: 63mW; Vmax: 50V; Type: Thick Film; ComponentLink1Description: Manufacturer; ComponentLink1URL: http://www.yageo.com/NewPortal/_en/index.jsp; ComponentLink2Description: Datasheet; ComponentLink2URL: http://www.farnell.com/datasheets/2167052.pdf; Manufacturer Part Number: RC0402FR-07100KL; Supplier 1: Farnell; Supplier Part Number 1: 9239472; Precision: ±1%
R?#4 R?#6 = RC0603FR-071KL: RES SMD 1K OHM 1% 1/10W 0603; Manufacturer: Yageo; Power: 100mW; Vmax: 50V; Manufacturer Part Number: RC0603FR-071KL; Type: Thick Film; ComponentLink1Description: Manufacturer; ComponentLink1URL: http://www.yageo.com/NewPortal/_en/index.jsp; ComponentLink2Description: Datasheet; ComponentLink2URL: http://www.farnell.com/datasheets/2167052.pdf; Precision: ±1%; Supplier 1: Farnell; Supplier Part Number 1: 9238484
R?#5 = RC0603FR-0768RL: RES SMD 68 OHM 1% 1/10W 0603; Manufacturer: Yageo; Power: 100mW; Vmax: 50V; Manufacturer Part Number: RC0603FR-0768RL; Type: Thick Film; ComponentLink1Description: Manufacturer; ComponentLink1URL: http://www.yageo.com/NewPortal/_en/index.jsp; ComponentLink2Description: Datasheet; ComponentLink2URL: http://www.farnell.com/datasheets/1868787.pdf; Supplier 1: Farnell; Supplier Part Number 1: 9238344; Precision: ±1%
R?#7 R?#8 = RC0603FR-0710KL: RES SMD 10K OHM 1% 1/10W 0603; Manufacturer: Yageo; Power: 100mW; Vmax: 50V; Manufacturer Part Number: RC0603FR-0710KL; Type: Thick Film; ComponentLink1Description: Manufacturer; ComponentLink1URL: http://www.yageo.com/NewPortal/_en/index.jsp; ComponentLink2Description: Datasheet; ComponentLink2URL: http://www.farnell.com/datasheets/2167052.pdf; Supplier 1: Farnell; Supplier Part Number 1: 9238603; Precision: ±1%
R?#9 = RC0402FR-071KL: RES SMD 1K OHM 1% 1/16W 0402; Manufacturer: Yageo; Power: 63mW; Vmax: 50V; Type: Thick Film; ComponentLink1Description: Manufacturer; ComponentLink1URL: http://www.yageo.com/NewPortal/_en/index.jsp; ComponentLink2Description: Datasheet; ComponentLink2URL: http://www.farnell.com/datasheets/2167052.pdf; Manufacturer Part Number: RC0402FR-071KL; Supplier 1: Farnell; Supplier Part Number 1: 9239235; Precision: ±1%
R?#12 R?#13 = RC0402FR-0710RL: RES SMD 10 OHM 1% 1/16W 0402; Manufacturer: Yageo; Power: 63mW; Vmax: 50V; Type: Thick Film; ComponentLink1Description: Manufacturer; ComponentLink1URL: http://www.yageo.com/NewPortal/_en/index.jsp; ComponentLink2Description: Datasheet; ComponentLink2URL: http://www.farnell.com/datasheets/1018594.pdf; Manufacturer Part Number: RC0402FR-0710RL; Supplier 1: Farnell; Supplier Part Number 1: 9238999; Precision: ±1%
S1 = 418121270808: SWITCH SLIDE DIP SPST 25MA 24V; Manufacturer: Wurth Electronics Inc.; Supplier 1: Digi-Key; Supplier Part Number 1: 732-6965-1-ND; Manufacturer Part Number: 418121270808; ComponentLink1URL: http://katalog.we-online.de/em/datasheet/4181212708xx.pdf; ComponentLink1Description: Datasheet
S? = MCIPTG23K-V: Switch MCIPTG23K-V Multicomp; Supplier 1: Farnell; Supplier Part Number 1: 1605470; Manufacturer: MULTICOMP; Manufacturer Part Number: MCIPTG23K-V; Pricing: 1=0.7, 50=0.65, 100=0.61, 500=0.57, 1000=0.53, 7000=0.37, 7000=0.333, 30000=0.3 (EUR); ComponentLink1URL: http://www.farnell.com/cad/1662547.pdf; ComponentLink1Description: http://www.farnell.com/cad/1662547.pdf
U1 = STM32F302K8U6: Manufacturer: STMICROELECTRONICS; Pricing: 1=0.5, 25=0.4, 100=0.33, 250=0.27, 500=0.228, 2000=0.16, 2000=0.157, 20000=0.154 (EUR); Supplier 1: Farnell; Manufacturer Part Number: STM32F302K8U6; Supplier Part Number 1: 2424420
U2 = LT1161CSW: IC MOSFET DRIVER N-CH QUAD20SOIC; Manufacturer: Linear Technology; Supplier 1: Farnell; Supplier Part Number 1: 1273476; Manufacturer Part Number: LT1161CSW; ComponentLink1URL: http://www.linear.com/docs/3607; ComponentLink1Description: Datasheet

## Sheet CaP_SRV.SchDoc
size A3; Author: Audran; CompanyName: Goldorak; Address1: Electrolab; Address2: 52 rue Paul Lescop; Address3: 92000 Nanterre; ProjectName: Cartes_2017
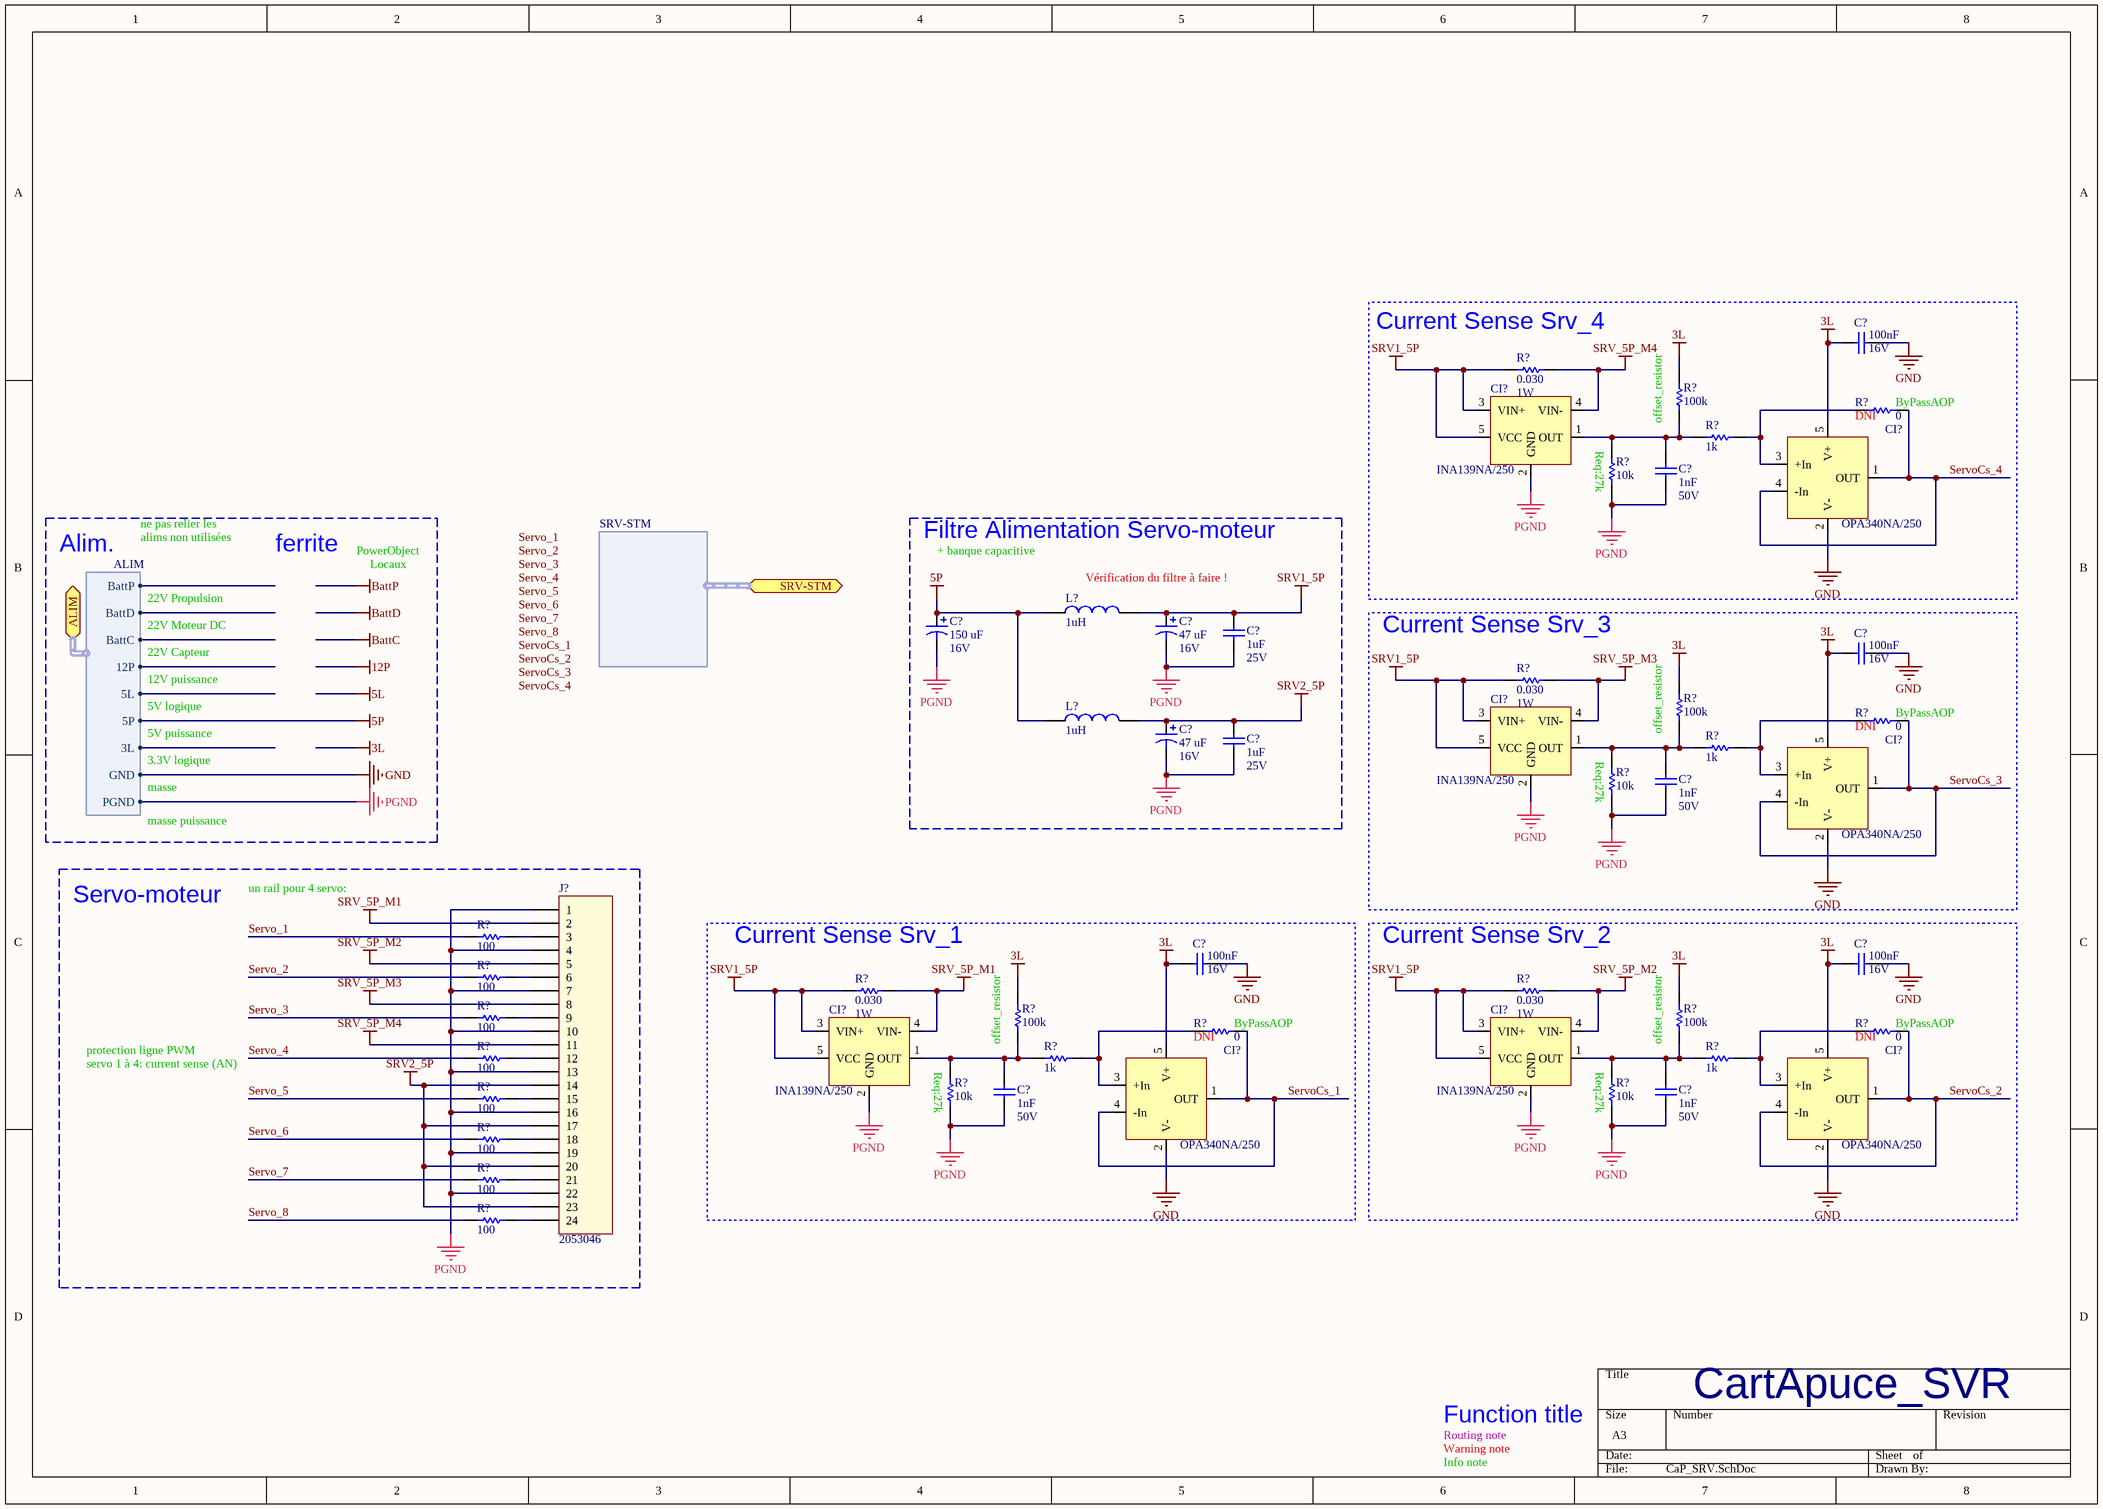
[diagram p3: CaP_SRV.SchDoc]

### Parts
(Parts that share a designator on the sheet are numbered #1, #2 ... from top to bottom, then left to right.)
C?#3  100nF  RatedVoltage: 16V  [WCAP-CSGP_0402, 1x0.5x0.5]
C?#4  1nF  RatedVoltage: 50V  [WCAP-CSGP_0402, 1x0.5x0.5]
C?#5  150 uF  RatedVoltage: 16V  [WCAP-ATG8_6.3x11x2.5x0.5]
C?#6  47 uF  RatedVoltage: 16V  [WCAP-ATG8_5x11x2x0.5]
C?#7  1uF  RatedVoltage: 25V  [WCAP-CSGP_0603, 1.6x0.8x0.8]
C?#8  100nF  RatedVoltage: 16V  [WCAP-CSGP_0402, 1x0.5x0.5]
C?#9  47 uF  RatedVoltage: 16V  [WCAP-ATG8_5x11x2x0.5]
C?#10  1uF  RatedVoltage: 25V  [WCAP-CSGP_0603, 1.6x0.8x0.8]
C?#11  1nF  RatedVoltage: 50V  [WCAP-CSGP_0402, 1x0.5x0.5]
C?#12  100nF  RatedVoltage: 16V  [WCAP-CSGP_0402, 1x0.5x0.5]
C?#13  100nF  RatedVoltage: 16V  [WCAP-CSGP_0402, 1x0.5x0.5]
C?#14  1nF  RatedVoltage: 50V  [WCAP-CSGP_0402, 1x0.5x0.5]
C?#15  1nF  RatedVoltage: 50V  [WCAP-CSGP_0402, 1x0.5x0.5]
CI?#1  INA139NA/250  [SOT95P245X145-5N]
CI?#2  OPA340NA/250  [SOT95P245X145-5N]
CI?#3  INA139NA/250  [SOT95P245X145-5N]
CI?#4  OPA340NA/250  [SOT95P245X145-5N]
CI?#5  INA139NA/250  [SOT95P245X145-5N]
CI?#6  INA139NA/250  [SOT95P245X145-5N]
CI?#7  OPA340NA/250  [SOT95P245X145-5N]
CI?#8  OPA340NA/250  [SOT95P245X145-5N]
J?#1  Supplier Part Number 1: 2053046  [TSW-108-08-F-T-RA]  (hidden comment: TSW-108-08-F-T-RA)
L?#1  value 1uH  [WE-PD2_4532]  (hidden comment: WE-PD2, 7447730)
L?#2  value 1uH  [WE-PD2_4532]  (hidden comment: WE-PD2, 7447730)
R?#14  value 0.030  Power: 1W  [WSLP1206]  (hidden comment: WSLP1206R0300FEA)
R?#15  value 0  [RESC1005X04N]  (hidden comment: RC0402JR-070RL)
R?#16  value 100k  [RESC1005X04N]  (hidden comment: RC0402FR-07100KL)
R?#17  value 1k  [RESC1005X04N]  (hidden comment: RC0402FR-071KL)
R?#18  value 10k  [RESC1005X04N]  (hidden comment: RC0402FR-0710KL)
R?#19  value 0.030  Power: 1W  [WSLP1206]  (hidden comment: WSLP1206R0300FEA)
R?#20  value 0  [RESC1005X04N]  (hidden comment: RC0402JR-070RL)
R?#21  value 100k  [RESC1005X04N]  (hidden comment: RC0402FR-07100KL)
R?#22  value 1k  [RESC1005X04N]  (hidden comment: RC0402FR-071KL)
R?#23  value 10k  [RESC1005X04N]  (hidden comment: RC0402FR-0710KL)
R?#24  value 100  [RESC1005X04N]  (hidden comment: RC0402FR-07100RL)
R?#25  value 100  [RESC1005X04N]  (hidden comment: RC0402FR-07100RL)
R?#26  value 0.030  Power: 1W  [WSLP1206]  (hidden comment: WSLP1206R0300FEA)
R?#27  value 0.030  Power: 1W  [WSLP1206]  (hidden comment: WSLP1206R0300FEA)
R?#28  value 100  [RESC1005X04N]  (hidden comment: RC0402FR-07100RL)
R?#29  value 0  [RESC1005X04N]  (hidden comment: RC0402JR-070RL)
R?#30  value 0  [RESC1005X04N]  (hidden comment: RC0402JR-070RL)
R?#31  value 100k  [RESC1005X04N]  (hidden comment: RC0402FR-07100KL)
R?#32  value 100k  [RESC1005X04N]  (hidden comment: RC0402FR-07100KL)
R?#33  value 100  [RESC1005X04N]  (hidden comment: RC0402FR-07100RL)
R?#34  value 1k  [RESC1005X04N]  (hidden comment: RC0402FR-071KL)
R?#35  value 1k  [RESC1005X04N]  (hidden comment: RC0402FR-071KL)
R?#36  value 100  [RESC1005X04N]  (hidden comment: RC0402FR-07100RL)
R?#37  value 10k  [RESC1005X04N]  (hidden comment: RC0402FR-0710KL)
R?#38  value 10k  [RESC1005X04N]  (hidden comment: RC0402FR-0710KL)
R?#39  value 100  [RESC1005X04N]  (hidden comment: RC0402FR-07100RL)
R?#40  value 100  [RESC1005X04N]  (hidden comment: RC0402FR-07100RL)
R?#41  value 100  [RESC1005X04N]  (hidden comment: RC0402FR-07100RL)

### Blocks framed on the sheet
Current Sense Srv_4: C?#3 C?#4 CI?#1 CI?#2 R?#14-R?#18
Filtre Alimentation Servo-moteur: C?#5-C?#7 C?#9 C?#10 L?#1 L?#2
Current Sense Srv_3: C?#8 C?#11 CI?#3 CI?#4 R?#19-R?#23
Servo-moteur: J?#1 R?#24 R?#25 R?#28 R?#33 R?#36 R?#39-R?#41
Current Sense Srv_1: C?#12 C?#14 CI?#5 CI?#7 R?#26 R?#29 R?#31 R?#34 R?#37
Current Sense Srv_2: C?#13 C?#15 CI?#6 CI?#8 R?#27 R?#30 R?#32 R?#35 R?#38

### Ports
ALIM (harness ALIM), SRV-STM (harness SRV-STM)

### Harnesses
SRV-STM: 
ALIM: BattP, BattD, BattC, 12P, 5L, 5P, 3L, GND, PGND

### Nets
3L: C?#3.1 C?#8.1 C?#12.1 C?#13.1 CI?#2.5(V+) CI?#4.5(V+) CI?#7.5(V+) CI?#8.5(V+) R?#16.2 R?#21.2 R?#31.2 R?#32.2
5P: C?#5.1 L?#1.1 L?#2.1 ; port ALIM.5P
GND: C?#3.2 C?#8.2 C?#12.2 C?#13.2 CI?#2.2(V-) CI?#4.2(V-) CI?#7.2(V-) CI?#8.2(V-) ; port ALIM.GND
PGND: C?#4.1 C?#5.2 C?#6.2 C?#7.1 C?#9.2 C?#10.1 C?#11.1 C?#14.1 C?#15.1 CI?#1.2(GND) CI?#3.2(GND) CI?#5.2(GND) CI?#6.2(GND) J?#1.1 J?#1.4 J?#1.7 J?#1.10 J?#1.13 J?#1.16 J?#1.19 J?#1.22 R?#18.1 R?#23.1 R?#37.1 R?#38.1 ; port ALIM.PGND
SRV1_5P: C?#6.1 C?#7.2 CI?#1.3(VIN+) CI?#1.5(VCC) CI?#3.3(VIN+) CI?#3.5(VCC) CI?#5.3(VIN+) CI?#5.5(VCC) CI?#6.3(VIN+) CI?#6.5(VCC) L?#1.2 R?#14.1 R?#19.1 R?#26.1 R?#27.1
SRV2_5P: C?#9.1 C?#10.2 J?#1.14 J?#1.17 J?#1.20 J?#1.23 L?#2.2
SRV_5P_M1: CI?#5.4(VIN-) J?#1.2 R?#26.2
SRV_5P_M2: CI?#6.4(VIN-) J?#1.5 R?#27.2
SRV_5P_M3: CI?#3.4(VIN-) J?#1.8 R?#19.2
SRV_5P_M4: CI?#1.4(VIN-) J?#1.11 R?#14.2
Servo_1: R?#24.1
Servo_2: R?#25.1
Servo_3: R?#28.1
Servo_4: R?#33.1
Servo_5: R?#36.1
Servo_6: R?#39.1
Servo_7: R?#40.1
Servo_8: R?#41.1
ServoCs_1: CI?#7.1(OUT) CI?#7.4(-In) R?#29.2
ServoCs_2: CI?#8.1(OUT) CI?#8.4(-In) R?#30.2
ServoCs_3: CI?#4.1(OUT) CI?#4.4(-In) R?#20.2
ServoCs_4: CI?#2.1(OUT) CI?#2.4(-In) R?#15.2
NetC?#4_2: C?#4.2 CI?#1.1(OUT) R?#16.1 R?#17.1 R?#18.2
NetC?#11_2: C?#11.2 CI?#3.1(OUT) R?#21.1 R?#22.1 R?#23.2
NetC?#14_2: C?#14.2 CI?#5.1(OUT) R?#31.1 R?#34.1 R?#37.2
NetC?#15_2: C?#15.2 CI?#6.1(OUT) R?#32.1 R?#35.1 R?#38.2
NetCI?#2_3: CI?#2.3(+In) R?#15.1 R?#17.2
NetCI?#4_3: CI?#4.3(+In) R?#20.1 R?#22.2
NetCI?#7_3: CI?#7.3(+In) R?#29.1 R?#34.2
NetCI?#8_3: CI?#8.3(+In) R?#30.1 R?#35.2
NetJ?#1_3: J?#1.3 R?#24.2
NetJ?#1_6: J?#1.6 R?#25.2
NetJ?#1_9: J?#1.9 R?#28.2
NetJ?#1_12: J?#1.12 R?#33.2
NetJ?#1_15: J?#1.15 R?#36.2
NetJ?#1_18: J?#1.18 R?#39.2
NetJ?#1_21: J?#1.21 R?#40.2
NetJ?#1_24: J?#1.24 R?#41.2

### Notes on the sheet
- (near R?#18) Req:27k
- (near R?#16) offset_resistor
- (near R?#15) DNI
- (near R?#15) ByPassAOP
- Alim.
- ne pas relier les
- alims non utilisées
- ferrite
- PowerObject
- Locaux
- + banque capacitive
- Vérification du filtre à faire !
- 22V Propulsion
- 22V Moteur DC
- 5V logique
- 12V puissance
- 22V Capteur
- (near R?#20) ByPassAOP
- 5V puissance
- 3.3V logique
- (near R?#23) Req:27k
- (near R?#21) offset_resistor
- (near R?#20) DNI
- masse
- masse puissance
- un rail pour 4 servo:
- protection ligne PWM
- (near R?#31) offset_resistor
- (near R?#29) DNI
- (near R?#29) ByPassAOP
- (near R?#32) offset_resistor
- (near R?#30) DNI
- (near R?#30) ByPassAOP
- servo 1 à 4: current sense (AN)
- (near R?#37) Req:27k
- (near R?#38) Req:27k
- Routing note
- Warning note
- Function title
- CartApuce_SVR
- Info note
- Labels drawn without touching a wire or pin: Servo_1, Servo_2, Servo_3, Servo_4, Servo_5, Servo_6, Servo_7, Servo_8, ServoCs_1, ServoCs_2, ServoCs_3, ServoCs_4

### Library data of the parts
C?#3 C?#8 C?#12 C?#13 = WCAP-CSGP, 885012205037: as C24 on sheet CaP_PWR; PublishedDate: Aug 2016; ComponentLink1Description: Manufacturer; ComponentLink1URL: http://www.we-online.de; ComponentLink2Description: Datasheet; ComponentLink2URL: http://katalog.we-online.com/pbs/datasheet/885012205037.pdf; Value: 100nF; Size: 0402; CeramicType: X7R; Manufacturer Part Number: 885012205037
C?#4 C?#11 C?#14 C?#15 = WCAP-CSGP, 885012205061: CAP CER 1nF 50V X7R 0402; Manufacturer: Wurth Elektronik; PublishedDate: Aug 2016; ComponentLink1Description: Manufacturer; ComponentLink1URL: http://www.we-online.de; ComponentLink2Description: Datasheet; ComponentLink2URL: http://katalog.we-online.com/pbs/datasheet/885012205061.pdf; Manufacturer Part Number: 885012205061; Value: 1nF; Size: 0402; CeramicType: X7R
C?#5 = WCAP-ATG8, 860010373008: CAP Alu 150 UF 20% 16 V; Manufacturer: Wurth Elektronik; PublishedDate: July 2016; ComponentLink1Description: Manufacturer; ComponentLink1URL: http://www.we-online.de; ComponentLink2Description: Datasheet; ComponentLink2URL: http://katalog.we-online.de/pbs/datasheet/860010373008.pdf; Manufacturer Part Number: 860010373008; Value: 150 uF; Size: 6.3mmx11mm
C?#6 C?#9 = WCAP-ATG8, 860010372004: CAP Alu 47 UF 20% 16 V; Manufacturer: Wurth Elektronik; PublishedDate: July 2016; ComponentLink1Description: Manufacturer; ComponentLink1URL: http://www.we-online.de; ComponentLink2Description: Datasheet; ComponentLink2URL: http://katalog.we-online.de/pbs/datasheet/860010372004.pdf; Manufacturer Part Number: 860010372004; Value: 47 uF; Size: 5mmx11mm
C?#7 C?#10 = WCAP-CSGP, 885012206076: CAP CER 1uF 25V X7R 0603; Manufacturer: Wurth Elektronik; PublishedDate: Aug 2016; ComponentLink1Description: Manufacturer; ComponentLink1URL: http://www.we-online.de; ComponentLink2Description: Datasheet; ComponentLink2URL: http://katalog.we-online.com/pbs/datasheet/885012206076.pdf; Manufacturer Part Number: 885012206076; Value: 1uF; Size: 0603; CeramicType: X7R
CI?#1 CI?#3 CI?#5 CI?#6 = INA139NA/250: IC CURRENT MONITOR 0.5% SOT23-5; Manufacturer: Texas Instruments; Supplier 1: Farnell; Supplier Part Number 1: 1470398; Manufacturer Part Number: INA139NA/250; ComponentLink1URL: http://www.ti.com/lit/ds/symlink/ina139.pdf; ComponentLink1Description: http://www.ti.com/lit/ds/symlink/ina139.pdf
CI?#2 CI?#4 CI?#7 CI?#8 = OPA340NA/250: IC OP AMP GP 5.5MHZ RRIO SOT23-5; Manufacturer: Texas Instruments; Supplier 1: Farnell; Supplier Part Number 1: 1470372; ComponentLink1URL: http://www.ti.com/lit/ds/symlink/opa2340.pdf; ComponentLink1Description: http://www.ti.com/lit/ds/symlink/opa2340.pdf; Manufacturer Part Number: OPA340NA/250
J?#1 = TSW-108-08-F-T-RA: samtec 3x8 : TSW-108-08-F-T-RA; Manufacturer Part Number: TSW-104-08-F-T-RA; Manufacturer 1: SAMTEC; ComponentLink2URL: http://cloud.samtec.com/catalog_english/TSW_TH.PDF; ComponentLink2Description: http://cloud.samtec.com/catalog_english/TSW_TH.PDF; Supplier 1: Farnell
L?#1 L?#2 = WE-PD2, 7447730: FIXED IND 1UH 4A 49 MOHM SMD; PublishedDate: Sep. 2016; Publisher: Wurth Elektronik; ComponentLink1Description: Manufacturer; ComponentLink1URL: http://www.we-online.de; ComponentLink2Description: Datasheet; ComponentLink2URL: http://katalog.we-online.de/pbs/datasheet/7447730.pdf; PartNumber: 7447730; Size: 4532
R?#14 R?#19 R?#26 R?#27 = WSLP1206R0300FEA: RES 0.03 OHM 1% 1W 1206; Manufacturer: Vishay Dale; Vmax: 200V; Type: Metal Strip; Precision: ±1%; ComponentLink1Description: http://www.vishay.com/docs/30122/wslp.pdf; Manufacturer Part Number: WSLP1206R0300FEA; ComponentLink1URL: http://www.vishay.com/docs/30122/wslp.pdf; Tolerance: ±1%; Power (Watts): 1W; Supplier Device Package: 1206; Supplier 1: Farnell; Supplier Part Number 1: 1886671
R?#15 R?#20 R?#29 R?#30 = RC0402JR-070RL: RES SMD 0 OHM 5% 1/16W 0402; Manufacturer: Yageo; Power: 63mW; Vmax: 50V; Type: Thick Film; ComponentLink1Description: Manufacturer; ComponentLink1URL: http://www.yageo.com/NewPortal/_en/index.jsp; ComponentLink2Description: Datasheet; ComponentLink2URL: http://www.farnell.com/datasheets/1018594.pdf; Manufacturer Part Number: RC0402JR-070RL; Supplier 1: Farnell; Supplier Part Number 1: 9232516; Precision: ±5%
R?#16 R?#21 R?#31 R?#32 = RC0402FR-07100KL: as R?#3 on sheet CaP_PWR; Type: Thick Film; ComponentLink1Description: Manufacturer; ComponentLink1URL: http://www.yageo.com/NewPortal/_en/index.jsp; ComponentLink2Description: Datasheet; ComponentLink2URL: http://www.farnell.com/datasheets/2167052.pdf; Manufacturer Part Number: RC0402FR-07100KL; Supplier 1: Farnell; Supplier Part Number 1: 9239472; Precision: ±1%
R?#17 R?#22 R?#34 R?#35 = RC0402FR-071KL: as R?#9 on sheet CaP_PWR; Type: Thick Film; ComponentLink1Description: Manufacturer; ComponentLink1URL: http://www.yageo.com/NewPortal/_en/index.jsp; ComponentLink2Description: Datasheet; ComponentLink2URL: http://www.farnell.com/datasheets/2167052.pdf; Manufacturer Part Number: RC0402FR-071KL; Supplier 1: Farnell; Supplier Part Number 1: 9239235; Precision: ±1%
R?#18 R?#23 R?#37 R?#38 = RC0402FR-0710KL: as R1 on sheet CaP_PWR; Type: Thick Film; ComponentLink1Description: Manufacturer; ComponentLink1URL: http://www.yageo.com/NewPortal/_en/index.jsp; ComponentLink2Description: Datasheet; ComponentLink2URL: http://www.farnell.com/datasheets/2167052.pdf; Supplier 1: Farnell; Supplier Part Number 1: 9239359; Manufacturer Part Number: RC0402FR-0710KL; Precision: ±1%
R?#24 R?#25 R?#28 R?#33 R?#36 R?#39-R?#41 = RC0402FR-07100RL: as R11 on sheet CaP_PWR; Type: Thick Film; ComponentLink1Description: Manufacturer; ComponentLink1URL: http://www.yageo.com/NewPortal/_en/index.jsp; ComponentLink2Description: Datasheet; ComponentLink2URL: http://www.farnell.com/datasheets/2167052.pdf; Manufacturer Part Number: RC0402FR-07100RL; Supplier 1: Farnell; Supplier Part Number 1: 9239111; Precision: ±1%